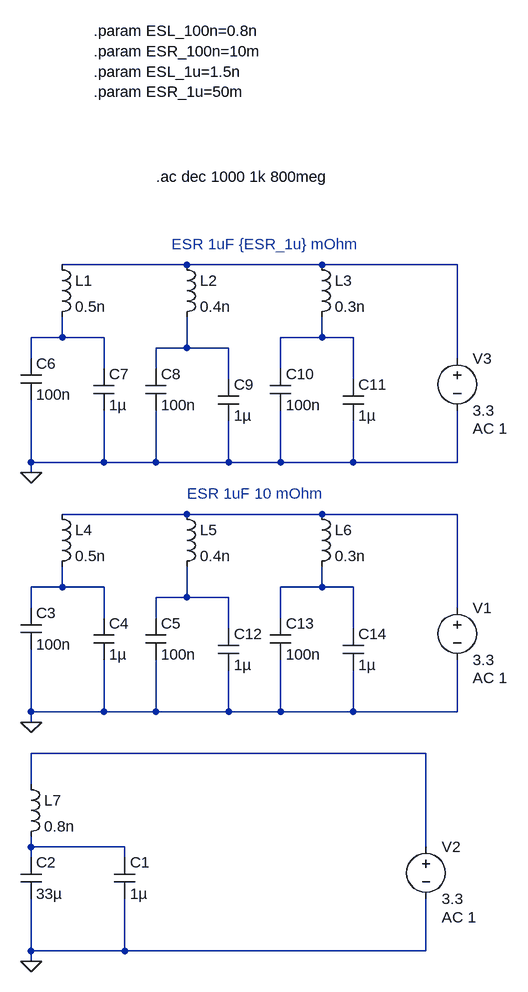
[diagram p0: schematic PDN.asc]
PDN.asc, the LTspice schematic file:
Version 4
SHEET 1 992 1524
WIRE 400 432 208 432
WIRE 608 432 400 432
WIRE 816 432 608 432
WIRE 208 544 208 512
WIRE 208 544 160 544
WIRE 272 544 208 544
WIRE 608 544 608 512
WIRE 608 544 544 544
WIRE 656 544 608 544
WIRE 400 560 400 512
WIRE 400 560 352 560
WIRE 464 560 400 560
WIRE 160 576 160 544
WIRE 816 576 816 432
WIRE 272 592 272 544
WIRE 352 592 352 560
WIRE 544 592 544 544
WIRE 464 608 464 560
WIRE 656 608 656 544
WIRE 160 736 160 640
WIRE 272 736 272 656
WIRE 272 736 160 736
WIRE 352 736 352 656
WIRE 352 736 272 736
WIRE 464 736 464 672
WIRE 464 736 352 736
WIRE 544 736 544 656
WIRE 544 736 464 736
WIRE 656 736 656 672
WIRE 656 736 544 736
WIRE 816 736 816 656
WIRE 816 736 656 736
WIRE 160 752 160 736
WIRE 400 816 208 816
WIRE 608 816 400 816
WIRE 816 816 608 816
WIRE 208 928 208 896
WIRE 208 928 160 928
WIRE 272 928 208 928
WIRE 608 928 608 896
WIRE 608 928 544 928
WIRE 656 928 608 928
WIRE 400 944 400 896
WIRE 400 944 352 944
WIRE 464 944 400 944
WIRE 160 960 160 928
WIRE 816 960 816 816
WIRE 272 976 272 928
WIRE 352 976 352 944
WIRE 544 976 544 928
WIRE 464 992 464 944
WIRE 656 992 656 928
WIRE 160 1120 160 1024
WIRE 272 1120 272 1040
WIRE 272 1120 160 1120
WIRE 352 1120 352 1040
WIRE 352 1120 272 1120
WIRE 464 1120 464 1056
WIRE 464 1120 352 1120
WIRE 544 1120 544 1040
WIRE 544 1120 464 1120
WIRE 656 1120 656 1056
WIRE 656 1120 544 1120
WIRE 816 1120 816 1040
WIRE 816 1120 656 1120
WIRE 160 1136 160 1120
WIRE 768 1184 160 1184
WIRE 160 1232 160 1184
WIRE 160 1328 160 1312
WIRE 304 1328 160 1328
WIRE 768 1328 768 1184
WIRE 160 1344 160 1328
WIRE 304 1344 304 1328
WIRE 160 1488 160 1408
WIRE 304 1488 304 1408
WIRE 304 1488 160 1488
WIRE 768 1488 768 1408
WIRE 768 1488 304 1488
WIRE 160 1504 160 1488
FLAG 160 752 0
FLAG 160 1136 0
FLAG 160 1504 0
SYMBOL voltage 816 944 R0
WINDOW 123 24 124 Left 2
WINDOW 39 0 0 Left 0
SYMATTR InstName V1
SYMATTR Value 3.3
SYMATTR Value2 AC 1
SYMBOL cap 144 576 R0
SYMATTR InstName C6
SYMATTR Value 100n
SYMATTR SpiceLine Rser={ESR_100n} Lser={ESL_100n}
SYMBOL voltage 816 560 R0
WINDOW 123 24 124 Left 2
WINDOW 39 0 0 Left 0
SYMATTR InstName V3
SYMATTR Value 3.3
SYMATTR Value2 AC 1
SYMBOL cap 256 592 R0
SYMATTR InstName C7
SYMATTR Value 1µ
SYMATTR SpiceLine Rser={ESR_1u} Lser={ESL_1u}
SYMBOL cap 336 592 R0
SYMATTR InstName C8
SYMATTR Value 100n
SYMATTR SpiceLine Rser={ESR_100n} Lser={ESL_100n}
SYMBOL cap 448 608 R0
SYMATTR InstName C9
SYMATTR Value 1µ
SYMATTR SpiceLine Rser={ESR_1u} Lser={ESL_1u}
SYMBOL cap 528 592 R0
SYMATTR InstName C10
SYMATTR Value 100n
SYMATTR SpiceLine Rser={ESR_100n} Lser={ESL_100n}
SYMBOL cap 640 608 R0
SYMATTR InstName C11
SYMATTR Value 1µ
SYMATTR SpiceLine Rser={ESR_1u} Lser={ESL_1u}
SYMBOL ind 192 416 R0
SYMATTR InstName L1
SYMATTR Value 0.5n
SYMBOL ind 384 416 R0
SYMATTR InstName L2
SYMATTR Value 0.4n
SYMBOL ind 592 416 R0
SYMATTR InstName L3
SYMATTR Value 0.3n
SYMBOL cap 144 960 R0
SYMATTR InstName C3
SYMATTR Value 100n
SYMATTR SpiceLine Rser=10m Lser=0.8n
SYMBOL cap 256 976 R0
SYMATTR InstName C4
SYMATTR Value 1µ
SYMATTR SpiceLine Rser=10m Lser=1.5n
SYMBOL cap 336 976 R0
SYMATTR InstName C5
SYMATTR Value 100n
SYMATTR SpiceLine Rser=10m Lser=0.8n
SYMBOL cap 448 992 R0
SYMATTR InstName C12
SYMATTR Value 1µ
SYMATTR SpiceLine Rser=10m Lser=1.5n
SYMBOL cap 528 976 R0
SYMATTR InstName C13
SYMATTR Value 100n
SYMATTR SpiceLine Rser=10m Lser=0.8n
SYMBOL cap 640 992 R0
SYMATTR InstName C14
SYMATTR Value 1µ
SYMATTR SpiceLine Rser=10m Lser=1.5n
SYMBOL ind 192 800 R0
SYMATTR InstName L4
SYMATTR Value 0.5n
SYMBOL ind 384 800 R0
SYMATTR InstName L5
SYMATTR Value 0.4n
SYMBOL ind 592 800 R0
SYMATTR InstName L6
SYMATTR Value 0.3n
SYMBOL voltage 768 1312 R0
WINDOW 123 24 124 Left 2
WINDOW 39 0 0 Left 0
SYMATTR InstName V2
SYMATTR Value 3.3
SYMATTR Value2 AC 1
SYMBOL cap 144 1344 R0
SYMATTR InstName C2
SYMATTR Value 33µ
SYMATTR SpiceLine Rser=70m Lser=1.8n
SYMBOL ind 144 1216 R0
SYMATTR InstName L7
SYMATTR Value 0.8n
SYMBOL cap 288 1344 R0
SYMATTR InstName C1
SYMATTR Value 1µ
SYMATTR SpiceLine Rser=10m Lser=1.8n
TEXT 352 296 Left 2 !.ac dec 1000 1k 800meg
TEXT 376 400 Left 2 ;ESR 1uF {ESR_1u} mOhm
TEXT 400 784 Left 2 ;ESR 1uF 10 mOhm
TEXT 256 72 Left 2 !.param ESL_100n=0.8n\n.param ESR_100n=10m\n.param ESL_1u=1.5n\n.param ESR_1u=50m

The netlist it stands for:
* PDN.asc
V1 N005 0 3.3 AC 1
C6 N002 0 100n Rser={ESR_100n} Lser={ESL_100n}
V3 N001 0 3.3 AC 1
C7 N002 0 1µ Rser={ESR_1u} Lser={ESL_1u}
C8 N004 0 100n Rser={ESR_100n} Lser={ESL_100n}
C9 N004 0 1µ Rser={ESR_1u} Lser={ESL_1u}
C10 N003 0 100n Rser={ESR_100n} Lser={ESL_100n}
C11 N003 0 1µ Rser={ESR_1u} Lser={ESL_1u}
L1 N001 N002 0.5n
L2 N001 N004 0.4n
L3 N001 N003 0.3n
C3 N006 0 100n Rser=10m Lser=0.8n
C4 N006 0 1µ Rser=10m Lser=1.5n
C5 N008 0 100n Rser=10m Lser=0.8n
C12 N008 0 1µ Rser=10m Lser=1.5n
C13 N007 0 100n Rser=10m Lser=0.8n
C14 N007 0 1µ Rser=10m Lser=1.5n
L4 N005 N006 0.5n
L5 N005 N008 0.4n
L6 N005 N007 0.3n
V2 N009 0 3.3 AC 1
C2 N010 0 33µ Rser=70m Lser=1.8n
L7 N009 N010 0.8n
C1 N010 0 1µ Rser=10m Lser=1.8n
.ac dec 1000 1k 800meg
* ESR 1uF {ESR_1u} mOhm
* ESR 1uF 10 mOhm
.param ESL_100n=0.8n
.param ESR_100n=10m
.param ESL_1u=1.5n
.param ESR_1u=50m
.backanno
.end

* Results of the author's LTspice run, read from the files saved beside the schematic
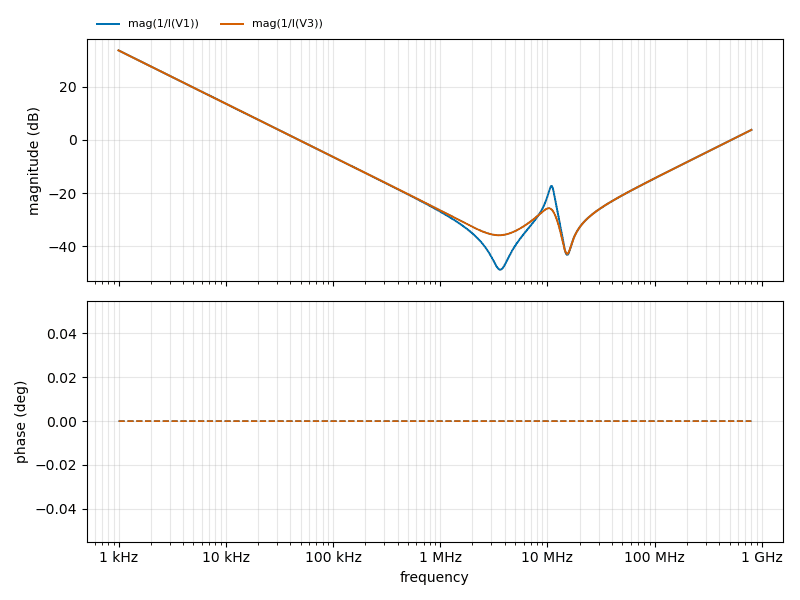
[diagram p1: AC Analysis of PDN.asc, plotted from the saved traces]
* AC Analysis, 1 run:
*   mag(1/I(V1)): 33.67 dB at 1 kHz, 3.78 dB at 800 MHz, peak 33.67 dB at 1 kHz, 3 dB below the peak at 1.414 kHz
*   mag(1/I(V3)): 33.67 dB at 1 kHz, 3.78 dB at 800 MHz, peak 33.67 dB at 1 kHz, 3 dB below the peak at 1.414 kHz